# EasyEDA schematic 1-Schematic_百味勺子.json
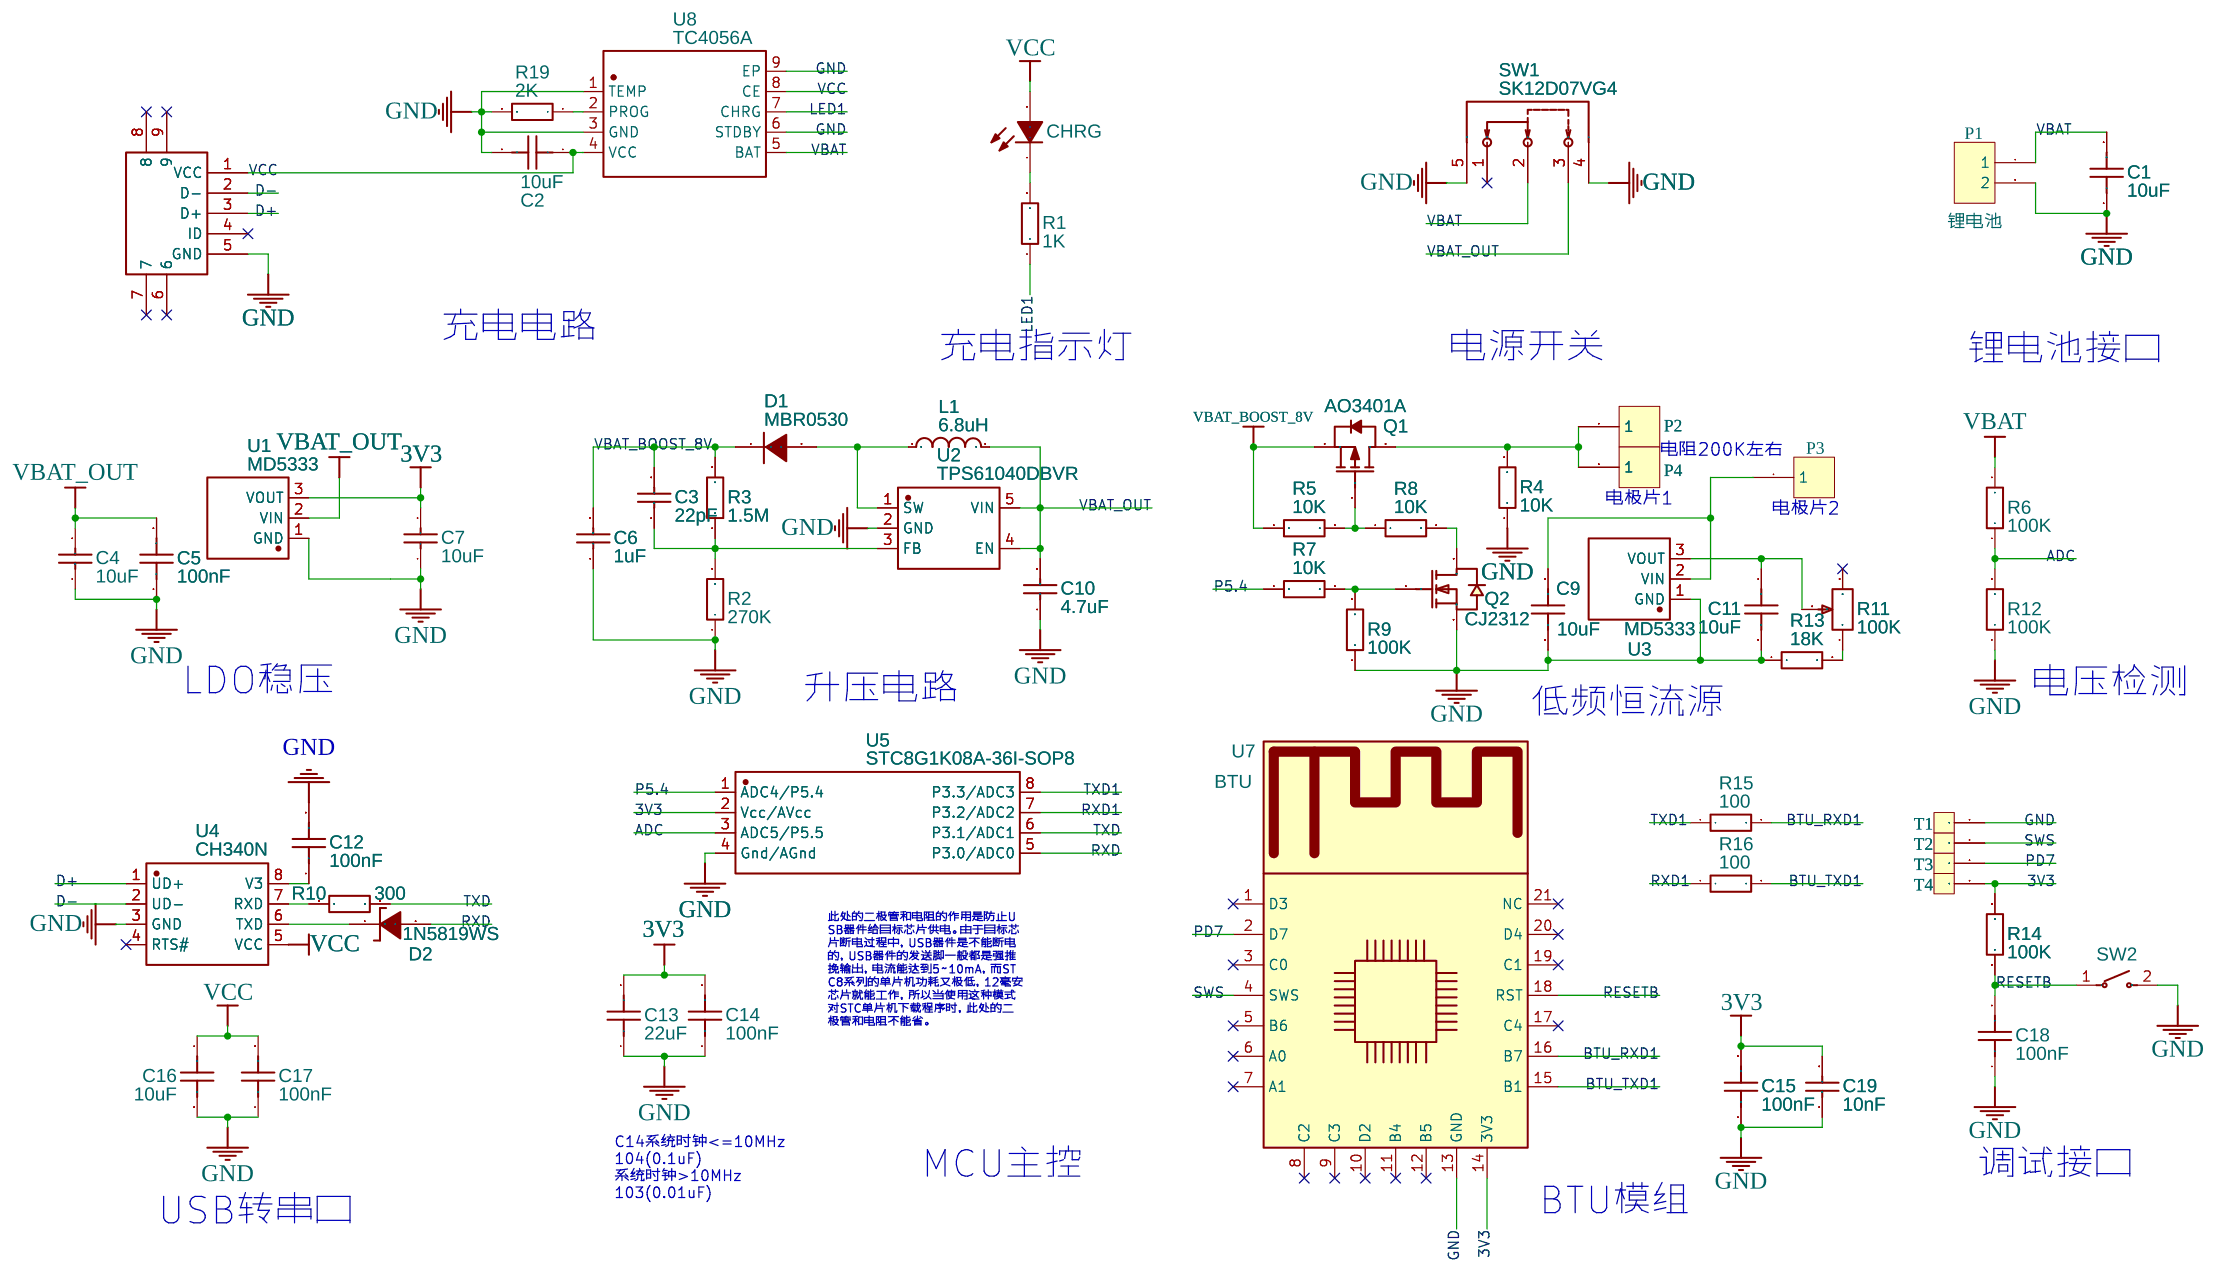
[diagram p0: schematic sheet]

## Parts
C1  10uF  [C0603]
C2  10uF  [C0603]
C3  22pF  [C0603]
C4  10uF  [C0603]
C5  100nF  [C0603]
C6  1uF  [C0603]
C7  10uF  [C0603]
C9  10uF  [C0603]
C10  4.7uF  [C0603]
C11  10uF  [C0603]
C12  100nF  [C0603]
C13  22uF  [C0603]
C14  100nF  [C0603]
C15  100nF  [C0603]
C16  10uF  [C0603]
C17  100nF  [C0603]
C18  100nF  [C0603]
C19  10nF  [C0603]
CHRG  19-21SURC/S530-A2/TR8  [LED0603-RD]
D1  MBR0530  [SOD-123_L2.8-W1.8-LS3.7-RD]
D2  1N5819WS  [SOD-323_L1.8-W1.3-LS2.5-RD]
L1  6.8uH  [IND-SMD_L3.8-W3.8_CDRH3D23NP]
P1  锂电池  [HDR-F-2.54_1X2]
P2  CON1  [__1]
P3  CON1  [__1]
P4  CON1  [__1]
Q1  AO3401A  [SOT-23_L2.9-W1.3-P1.90-LS2.4-BR]
Q2  CJ2312  [SOT-23_L2.9-W1.3-P1.90-LS2.4-BR]
R1  1K  [R0603]
R2  270K  [R0603]
R3  1.5M  [R0603]
R4  10K  [R0603]
R5  10K  [R0603]
R6  100K  [R0603]
R7  10K  [R0603]
R8  10K  [R0603]
R9  100K  [R0603]
R10  300  [R0603]
R11  100K  [RES-ADJ-SMD_VG039NCH]
R12  100K  [R0603]
R13  18K  [R0603]
R14  100K  [R0603]
R15  100  [R0603]
R16  100  [R0603]
R19  2K  [R0603]
SW1  SK12D07VG4  [SW-TH_SK12D07VG4]
SW2  TS-1088R-02026  [SW-SMD_L3.9-W3.0-P4.45]
T1  TP  [TP1]
T2  TP  [TP1]
T3  TP  [TP1]
T4  TP  [TP1]
U1  MD5333  [SOT-89-3_L4.5-W2.5-P1.50-LS4.2-BR]
U2  TPS61040DBVR  [SOT-23-5_L3.0-W1.7-P0.95-LS2.8-BR]
U3  MD5333  [SOT-89-3_L4.5-W2.5-P1.50-LS4.2-BR]
U4  CH340N  [SOP-8_L5.0-W4.0-P1.27-LS6.0-BL]
U5  STC8G1K08A-36I-SOP8  [SOP-8_L5.0-W4.0-P1.27-LS6.0-BL]
U7  BTU  [BTU]
U8  TC4056A  [SOP-8_L4.9-W3.9-P1.27-LS6.0-BL-EP]
USB1  U254-051T-4BH23-S2S  [MICRO-USB-SMD_C319163]

## Library data of the parts
C1 C2 C9 C11 C16 = CL10A106KP8NNNC: Supplier: LCSC; Manufacturer: SAMSUNG; Supplier Part: C19702; SMT Type: Basic; JLCPCB SMD: Yes
C3 = CC0603JRNPO9BN220: Supplier: LCSC; Manufacturer: YAGEO; Supplier Part: C105620; JLCPCB Part Class: Extended Part
C4 C7 = CC0603MRX5R6BB106: Supplier: LCSC; Manufacturer: YAGEO; Supplier Part: C109453; JLCPCB Part Class: Extended Part
C5 = 0603F104Z500: Supplier: LCSC; Manufacturer: WTC; Supplier Part: C83060; JLCPCB Part Class: Extended Part
C6 = CL10A105KO8NNNC: Supplier: LCSC; Manufacturer: SAMSUNG; Supplier Part: C1592; JLCPCB Part Class: Extended Part
C10 = CL10A475KP8NNNC: Supplier: LCSC; Manufacturer: SAMSUNG; Supplier Part: C1705; JLCPCB Part Class: Extended Part
C12 C14 C15 C17 C18 = CC0603KRX7R9BB104: Supplier: LCSC; Manufacturer: YAGEO; Supplier Part: C14663; JLCPCB Part Class: Basic Part
C13 = CL10A226MQ8NRNC: Supplier: LCSC; Manufacturer: SAMSUNG; LCSC Assembly: Yes; Supplier Part: C59461; SMT Type: Basic
C19 = CC0603KRX7R9BB103: Supplier: LCSC; Manufacturer: YAGEO; Supplier Part: C100042; JLCPCB Part Class: Extended Part
CHRG = 19-21SURC/S530-A2/TR8: Supplier: LCSC; Manufacturer: EVERLIGHT; image: //image.lceda.cn/szlcsc/C72045.jpg; Supplier Part: C72045; SMT Type: Extend; JLCPCB SMD: Yes
D1 = MBR0530_C475718: Supplier: LCSC; Supplier Part: C475718; Manufacturer: Shikues; Contributor: LCSC; JLCPCB Part Class: Extended Part
D2 = 1N5819WS: Supplier: LCSC; Supplier Part: C191023; Manufacturer: Guangdong Hottech; Contributor: LCSC; JLCPCB Part Class: Extended Part
L1 = CDRH3D23NP-6R8PC: Supplier: LCSC; Supplier Part: C323532; Manufacturer: Sumida; Contributor: LCSC
Q1 = AO3401A: Supplier: LCSC; Manufacturer: AOS; Supplier Part: C15127; JLCPCB Part Class: Basic Part
Q2 = CJ2312: Supplier: LCSC; Manufacturer: CJ; Supplier Part: C23521; JLCPCB Part Class: Extended Part
R1 = RS-03K1001FT: Supplier: LCSC; Manufacturer: FH; Supplier Part: C115325; JLCPCB Part Class: Extended Part
R2 = 0603WAF2703T5E: Supplier: LCSC; Manufacturer: UniOhm; Supplier Part: C22965; JLCPCB Part Class: Basic Part
R3 = 0603WAF1504T5E: Supplier: LCSC; Manufacturer: UniOhm; Supplier Part: C4172; JLCPCB Part Class: Basic Part
R4 R5 R7 R8 = RS-03K103JT: Supplier: LCSC; Manufacturer: FH; Supplier Part: C73809; JLCPCB Part Class: Extended Part
R6 R9 R12 R14 = RC0603FR-07100KL: Supplier: LCSC; Supplier Part: C14675; Manufacturer: YAGEO; Contributor: LCSC; JLCPCB Part Class: Extended Part
R10 = 0603WAF3000T5E: Supplier: LCSC; Manufacturer: UniOhm; LCSC Assembly: Yes; Supplier Part: C23025; SMT Type: Basic
R11 = VG039NCHXTB104: Supplier: LCSC; Manufacturer: HDK; Contributor: LCSC; Supplier Part: C128545; JLCPCB Part Class: Extended Part
R13 = WR06X1502FTL: Supplier: LCSC; Manufacturer: WALSIN; Contributor: LCSC; Supplier Part: C163863; JLCPCB Part Class: Extended Part
R15 R16 = 0603WAJ0101T5E: Supplier: LCSC; Manufacturer: UniOhm; Supplier Part: C25201; JLCPCB Part Class: Extended Part
R19 = 0603WAJ0202T5E: Supplier: LCSC; Manufacturer: UniOhm; Supplier Part: C25590
SW1 = SK12D07VG4: Supplier: LCSC; Supplier Part: C393937; Manufacturer: SHOU HAN; Contributor: LCSC; JLCPCB Part Class: Extended Part
SW2 = TS-1088R-02026: Supplier: LCSC; Supplier Part: C455280; Manufacturer: XUNPU; Contributor: LCSC; JLCPCB Part Class: Extended Part
U1 U3 = MD5333: Supplier: LCSC; Supplier Part: C2827936; Manufacturer: 明达微; Contributor: LCSC; JLCPCB Part Class: Extended Part
U2 = TPS61040DBVR: Supplier: LCSC; Manufacturer: TI; Supplier Part: C7722; JLCPCB Part Class: Basic Part
U4 = CH340N: Supplier: LCSC; Supplier Part: C506813; Manufacturer: WCH(Jiangsu Qin Heng); Contributor: LCSC; JLCPCB Part Class: Extended Part
U5 = STC8G1K08A-36I-SOP8: Supplier: LCSC; Supplier Part: C915663; Manufacturer: STC Micro; Contributor: LCSC; JLCPCB Part Class: Extended Part
U7 = BTU: Manufacturer: TUYA; link: https://developer.tuya.com/cn/docs/iot/btu-module-datasheet?id=Kakc18n7eo9k3; Contributor: asxs
U8 = TC4056A: Supplier: LCSC; Manufacturer: FM; Supplier Part: C84051; JLCPCB Part Class: Extended Part
USB1 = U254-051T-4BH23-S2S: Supplier: LCSC; Supplier Part: C319163; Manufacturer: XKB Enterprise; Contributor: LCSC; JLCPCB Part Class: Extended Part

## Nets
3V3: C7.2 C13.2 C14.2 C15.2 C19.2 R14.2 T4.1 U1.3(VOUT) U5.2(Vcc/AVcc) U7.14(3V3)
GND: C1.1 C2.2 C4.1 C5.1 C6.1 C7.1 C9.2 C10.1 C11.2 C12.2 C13.1 C14.1 C15.1 C16.2 C17.1 C18.1 C19.1 P1.2 Q2.2(S) R2.1 R4.1 R9.1 R12.1 R13.1 R19.2 SW1.4 SW1.5 SW2.2 T1.1 U1.1(GND) U2.2(GND) U3.1(GND) U4.3(GND) U5.4(Gnd/AGnd) U7.13(GND) U8.1(TEMP) U8.3(GND) U8.6(STDBY) U8.9(EP) USB1.5(GND)
VBAT: C1.2 P1.1 R6.2 SW1.2 U8.5(BAT)
VBAT_BOOST_8V: C3.2 C6.2 D1.1(K) Q1.2(S) R3.2 R5.1
VBAT_OUT: C4.2 C5.2 C10.2 L1.2 SW1.3 U1.2(VIN) U2.4(EN) U2.5(VIN)
VCC: C2.1 C16.1 C17.2 CHRG.2(+) U4.5(VCC) U8.4(VCC) U8.8(CE) USB1.1(VCC)
ADC: R6.1 R12.2 U5.3(ADC5/P5.5)
BTU_RXD1: R15.2 U7.16(B7)
BTU_TXD1: R16.2 U7.15(B1)
D+: U4.1(UD+) USB1.3(D+)
D-: U4.2(UD-) USB1.2(D-)
LED1: R1.1 U8.7(CHRG)
P5.4: R7.1 U5.1(ADC4/P5.4)
PD7: T3.1 U7.2(D7)
RESETB: C18.2 R14.1 SW2.1 U7.18(RST)
RXD: D2.2(A) U5.5(P3.0/ADC0)
RXD1: R16.1 U5.7(P3.2/ADC2)
SWS: T2.1 U7.4(SWS)
TXD: R10.2 U5.6(P3.1/ADC1)
TXD1: R15.1 U5.8(P3.3/ADC3)
Net-(C3-1): C3.1 R2.2 R3.1 U2.3(FB)
Net-(C9-1): C9.1 P3.1 U3.2(VIN)
Net-(C11-1): C11.1 R11.2 U3.3(VOUT)
Net-(C12-1): C12.1 U4.8(V3)
Net-(CHRG-1): CHRG.1(-) R1.2
Net-(D1-2): D1.2(A) L1.1 U2.1(SW)
Net-(D2-1): D2.1(C) U4.6(TXD)
Net-(P2-1): P2.1 P4.1 Q1.3(D) R4.2
Net-(Q1-1): Q1.1(G) R5.2 R8.1
Net-(Q2-1): Q2.1(G) R7.2 R9.2
Net-(Q2-3): Q2.3(D) R8.2
Net-(R10-1): R10.1 U4.7(RXD)
Net-(R11-1): R11.1 R13.2
Net-(R19-1): R19.1 U8.2(PROG)

Not connected (* = marked no-connect by the designer): R11 3*; SW1 1*; U4 4(RTS#)*; U7 1(D3)* 3(C0)* 5(B6)* 6(A0)* 7(A1)* 8(C2)* 9(C3)* 10(D2)* 11(B4)* 12(B5)* 17(C4)* 19(C1)* 20(D4)* 21(NC)*; USB1 4(ID)* 6* 7* 8* 9*

## Notes on the sheet
- 充电电路
- 充电指示灯
- 电源开关
- 锂电池接口
- 电阻200K左右
- 电极片1
- 电极片2
- LDO稳压
- 升压电路
- 电压检测
- 低频恒流源
- 此处的二极管和电阻的作用是防止U
  SB器件给目标芯片供电。由于目标芯
  片断电过程中，USB器件是不能断电
  的，USB器件的发送脚一般都是强推
  挽输出，电流能达到5～10mA，而ST
  C8系列的单片机功耗又极低，12毫安
  芯片就能工作，所以当使用这种模式
  对STC单片机下载程序时，此处的二
  极管和电阻不能省。
- C14系统时钟<=10MHz
  104(0.1uF)
  系统时钟>10MHz
  103(0.01uF)
- MCU主控
- 调试接口
- BTU模组
- USB转串口
- *咸味：20-50uA的低频率电流,50200Hz
